# EAGLE design GBM-Hall (EAGLE 5.10)
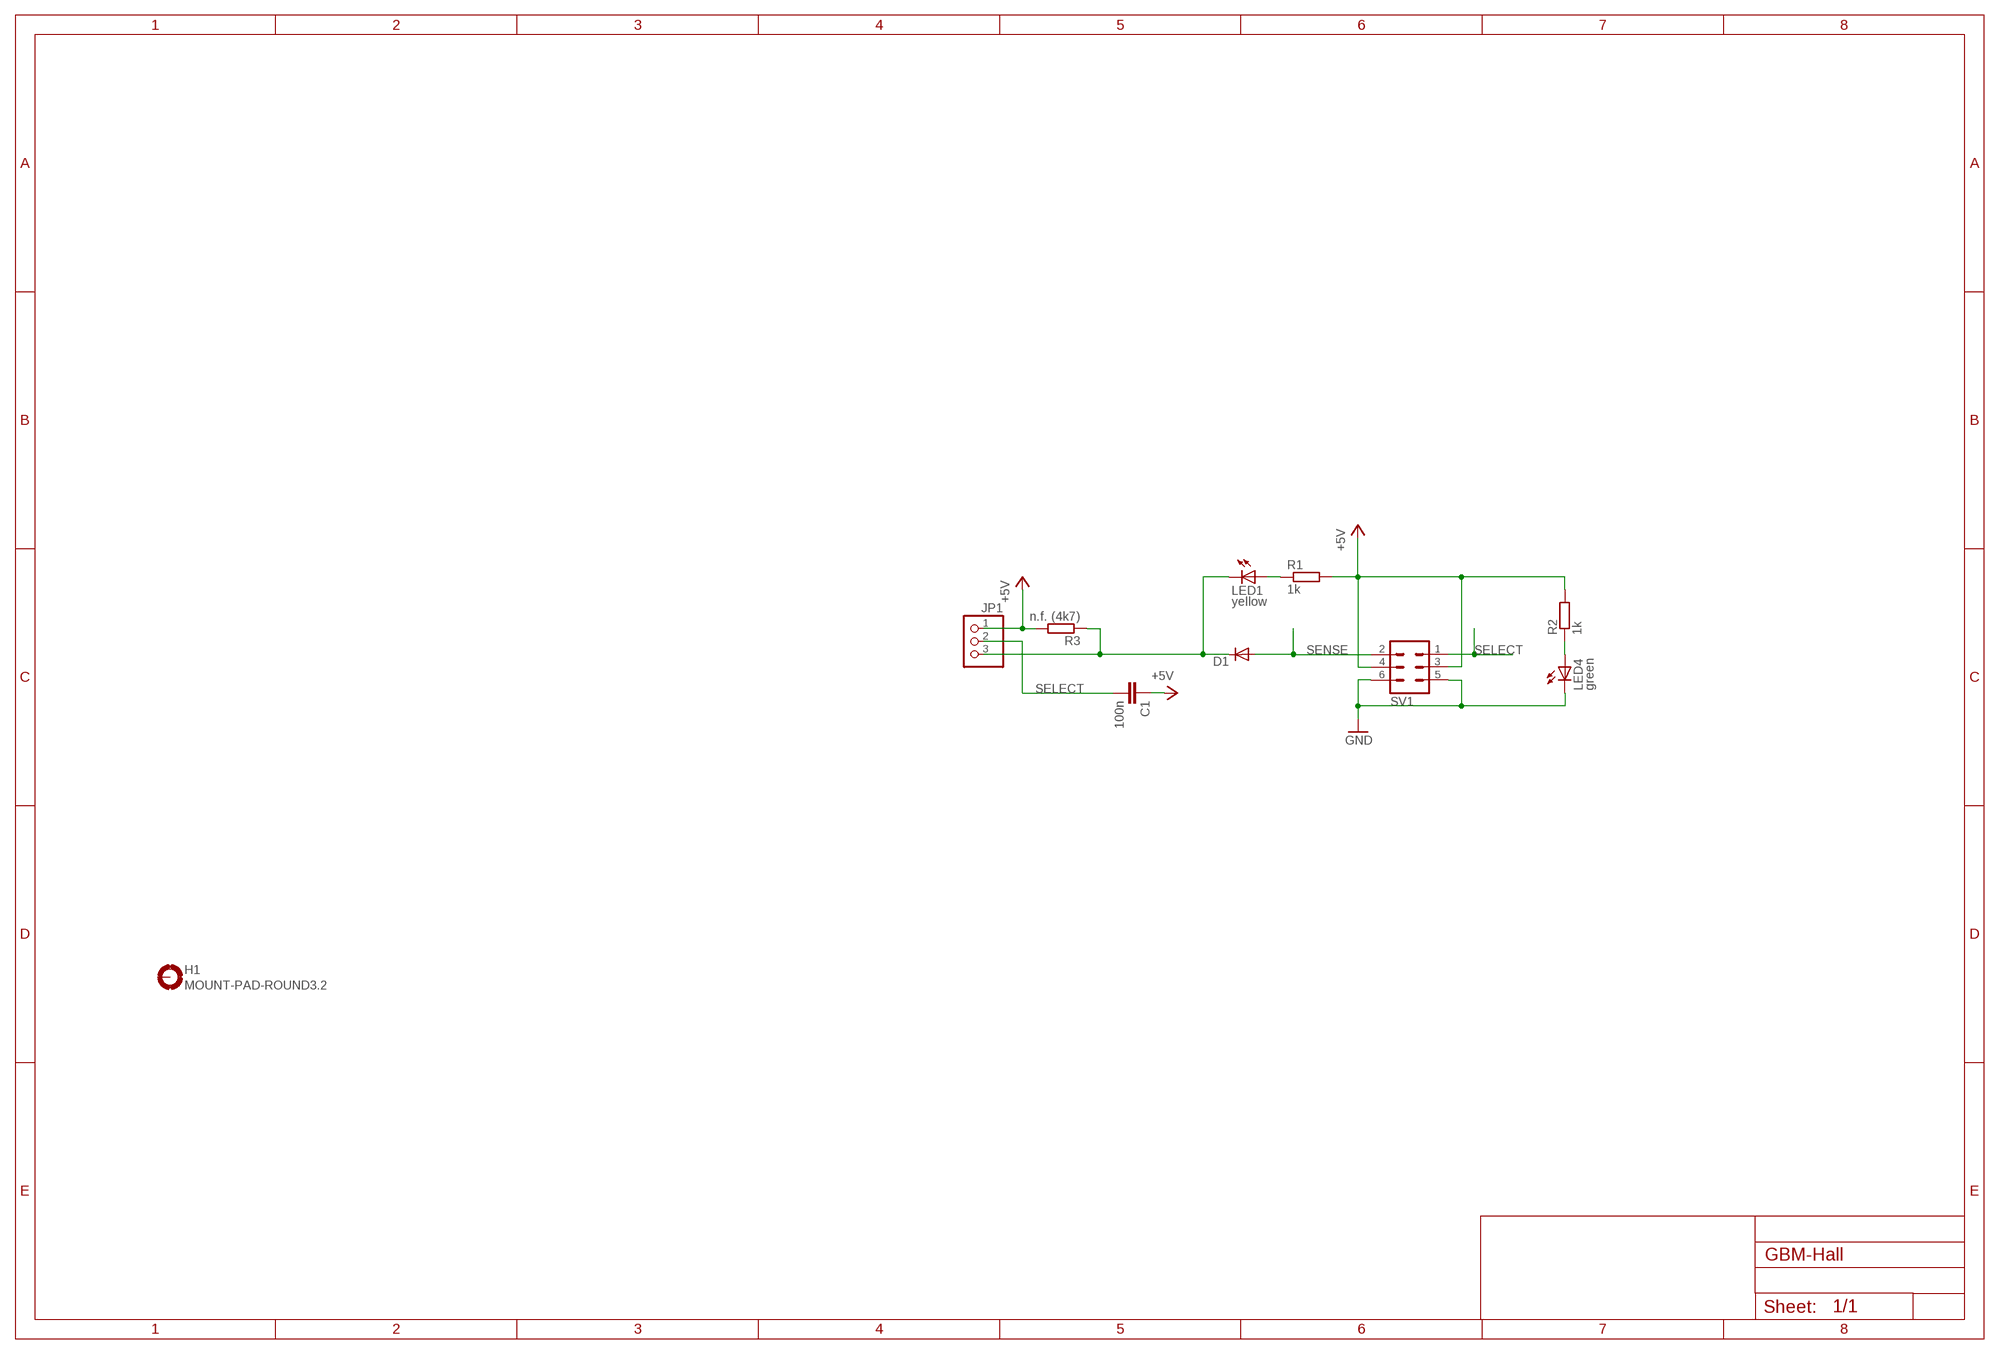
[diagram p0: schematic, sheet 1]

## Parts
C1  100n  C-EUC1206  [C1206]
D1  DIODE-MINIMELF  [MINIMELF]
H1  MOUNT-PAD-ROUND3.2  [3,2-PAD]
JP1  PINHD-1X3  [1X03]
LED1  yellow  LED3MM  [LED3MM]
LED4  green  LED3MM  [LED3MM]
R1  1k  R-EU_R1206  [R1206]
R2  1k  R-EU_R1206  [R1206]
R3  n.f. (4k7)  R-EU_R1206  [R1206]
SV1  ML6  [ML6]

## Nets
+5V: C1.1 JP1.1 R1.2 R2.2 R3.2 SV1.3 SV1.4
GND: LED4.K(C) SV1.5 SV1.6
N$3: LED4.A R2.1
N$4: LED1.A R1.1
N$7: D1.C JP1.3 LED1.K(C) R3.1
SELECT: C1.2 JP1.2 SV1.1
SENSE: D1.A SV1.2
Unconnected: H1.B3,2(MOUNT)

## Library data of the parts
C1 = rcl:C-EU: CAPACITOR, European symbol
D1 = diode:DIODE-: DIODE
H1 = holes:MOUNT-PAD-ROUND: MOUNTING PAD, round
JP1 = pinhead:PINHD-1X3: PIN HEADER
LED1 LED4 = led:LED: LED OSRAM: - CHIPLED LG R971, LG N971, LY N971, LG Q971, LY Q971, LO R971, LY R971 LH N974, LH R974 LS Q976, LO Q976, LY Q976 LO Q996 - Hyper CHIPLED LW Q18S LB Q993, LB Q99A, LB R99A - SideLED LS A670, LO A670, LY A670, LG A670, LP A670 LB A673, LV A673, LT A673, LW A673 LH A674 LY A675 LS A676, LA A676, LO A676, LY A676, LW A676 LS A679, LY A679, LG A679 - Hyper Micro SIDELED® LS Y876, LA Y876, LO Y876, LY Y876 LT Y87S - SmartLED LW L88C, LW L88S LB L89C, LB L89S, LG L890 LS L89K, LO L89K, LY L89K LS L896, LA L896, LO L896, LY L896 - TOPLED LS T670, LO T670, LY T670, LG T670, LP T670 LSG T670, LSP T670, LSY T670, LOP T670, LYG T670 LG T671, LOG T671, LSG T671 LB T673, LV T673, LT T673, LW T673 LH T674 LS T676, LA T676, LO T676, LY T676, LB T676, LH T676, LSB T676, LW T676 LB T67C, LV T67C, LT T67C, LS T67K, LO T67K, LY T67K, LW E67C LS E67B, LA E67B, LO E67B, LY E67B, LB E67C, LV E67C, LT E67C LW T67C LS T679, LY T679, LG T679 LS T770, LO T770, LY T770, LG T770, LP T770 LB T773, LV T773, LT T773, LW T773 LH T774 LS E675, LA E675, LY E675, LS T675 LS T776, LA T776, LO T776, LY T776, LB T776 LHGB T686 LT T68C, LB T68C - Hyper Mini TOPLED® LB M676 - Mini TOPLED Santana® LG M470 LS M47K, LO M47K, LY M47K Source: http://www.osram.convergy.de LUXEON: - LUMILED® LXK2-PW12-R00, LXK2-PW12-S00, LXK2-PW14-U00, LXK2-PW14-V00 LXK2-PM12-R00, LXK2-PM12-S00, LXK2-PM14-U00 LXK2-PE12-Q00, LXK2-PE12-R00, LXK2-PE12-S00, LXK2-PE14-T00, LXK2-PE14-U00 LXK2-PB12-K00, LXK2-PB12-L00, LXK2-PB12-M00, LXK2-PB14-N00, LXK2-PB14-P00, LXK2-PB14-Q00 LXK2-PR12-L00, LXK2-PR12-M00, LXK2-PR14-Q00, LXK2-PR14-R00 LXK2-PD12-Q00, LXK2-PD12-R00, LXK2-PD12-S00 LXK2-PH12-R00, LXK2-PH12-S00 LXK2-PL12-P00, LXK2-PL12-Q00, LXK2-PL12-R00 Source: www.luxeon.com KINGBRIGHT: KA-3528ASYC Source: www.kingbright.com
R1-R3 = rcl:R-EU_: RESISTOR, European symbol
SV1 = con-harting-ml:ML6: HARTING

## Board
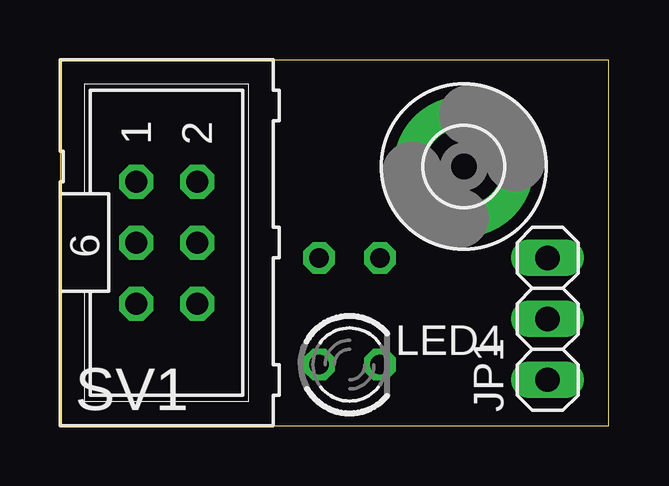
[diagram p1: board, top side]
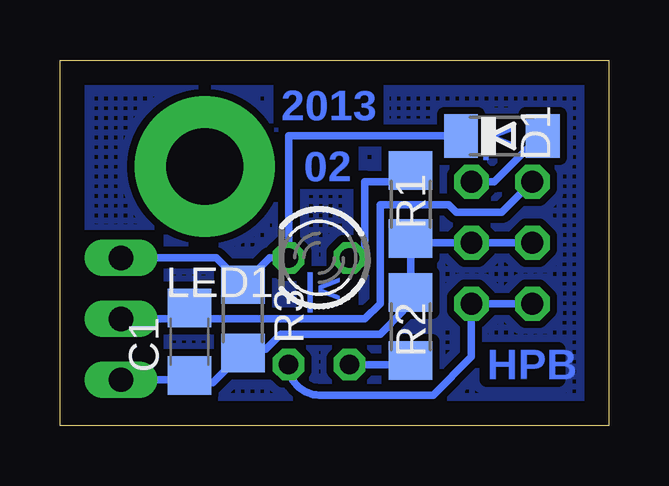
[diagram p2: board, bottom side, seen from below]

Size 22.86 x 15.23 mm. Coordinates in mm from the lower left corner, seen from the top.
Outline: 0,0 22.86,0 22.86,15.23 0,15.23 0,0
Copper layers (1*16): Top 0.035mm / dielectric 1.5mm / Bottom 0.035mm
Design rules "default": minimum track width 10mil, minimum drill 24mil, track to track 8mil, track to pad 8mil, pad to pad 8mil, via to via 8mil, smd to smd 8mil, copper to edge 40mil, drill to drill 8mil, minimum pad ring 10mil, minimum via ring 8mil, stop-mask expansion 4mil, vias tented up to drill 0mil, thermal gap 10mil

### Footprints (pad centres in the part's own frame; a part is rotated, then mirrored left to right if it is on the bottom)
C1206 = smd 1.6 x 1.8: 1 -1.4,0; 2 1.4,0
MINIMELF = smd 1.4 x 1.8: A 1.7,0; C -1.7,0
3,2-PAD = drill 3.2 pad 5.842 round: B3,2 0,0
1X03 = drill 1.016 long: 1 -2.54,0; 2 0,0; 3 2.54,0
LED3MM = drill 0.813 octagon: A -1.27,0; K 1.27,0
R1206 = smd 1.6 x 1.803: 1 -1.422,0; 2 1.422,0
ML6 = drill 0.914 octagon: 1 -2.54,-1.27; 2 -2.54,1.27; 3 0,-1.27; 4 0,1.27; 5 2.54,-1.27; 6 2.54,1.27

### Placement (x,y rotation side)
C1  17.46,3.49 90 bottom
D1  4.45,12.06 0 bottom
H1  16.83,10.79 0 top
JP1  20.32,4.45 90 top
LED1  12.06,6.99 180 bottom
LED4  12.06,2.54 0 top
R1  8.26,9.21 270 bottom
R2  8.26,4.13 90 bottom
R3  15.24,4.45 270 bottom
SV1  4.45,7.62 270 top

### Tracks (layer width: path | path; a pad name or v marks a point on that pad's centre or on a via)
+5V
  Bottom 0.305: SV1.3 SV1.4 8.26,7.62 R1.2 R2.2 8.57,4.76 9.53,3.81 13.65,3.81 14.29,3.17 15.09,3.17 R3.2 16.49,1.77 C1.1 17.59,1.91 JP1.1
GND
  Bottom 0.305: LED4.K arc-90 12.06,1.27 7.3,1.27 5.71,2.86 SV1.6 SV1.5
N$2
  pour Bottom (isolate 0.305, rank 2, no thermals, hatched): 0,0 18.41,0 18.41,8.26 22.54,8.26 22.54,15.24 0,15.24
N$3
  Bottom 0.305: LED4.A 8.42,2.54 R2.1
N$4
  Bottom 0.305: LED1.A 10.16,6.99 10.16,10.16 8.26,10.16 R1.1
N$7
  Bottom 0.305: D1.C 13.34,12.06 LED1.K 14.12,6.99 R3.1 16.36,6.99 JP1.3
SELECT
  Bottom 0.305: 17.14,4.45 JP1.2 | SV1.1 4.45,8.89 6.35,8.89 6.67,9.21 9.53,9.21 9.53,5.08 10.16,4.45 17.14,4.45 | 17.14,4.45 C1.2
SENSE
  Bottom 0.305: D1.A 2.86,12.06 4.76,10.16 SV1.2

### Text on the board
Bottom: |< | 2013 | 02 | |< | HPB